# Altium schematic sheet Sheet1.SchDoc
size A
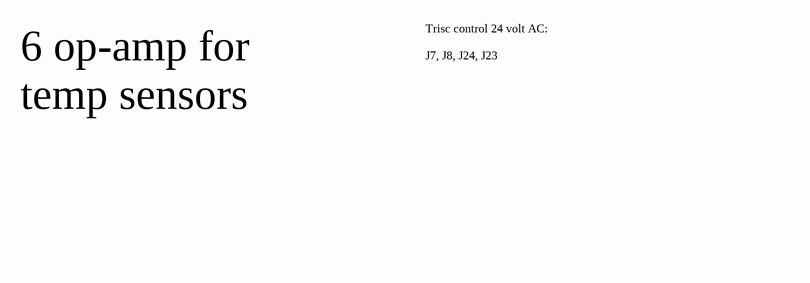
[diagram p0: Sheet1.SchDoc]

## Notes on the sheet
- 6 op-amp for temp sensors
- Trisc control 24 volt AC:
  J7, J8, J24, J23